# Altium project 充电桩底板V1.1.PrjPcb
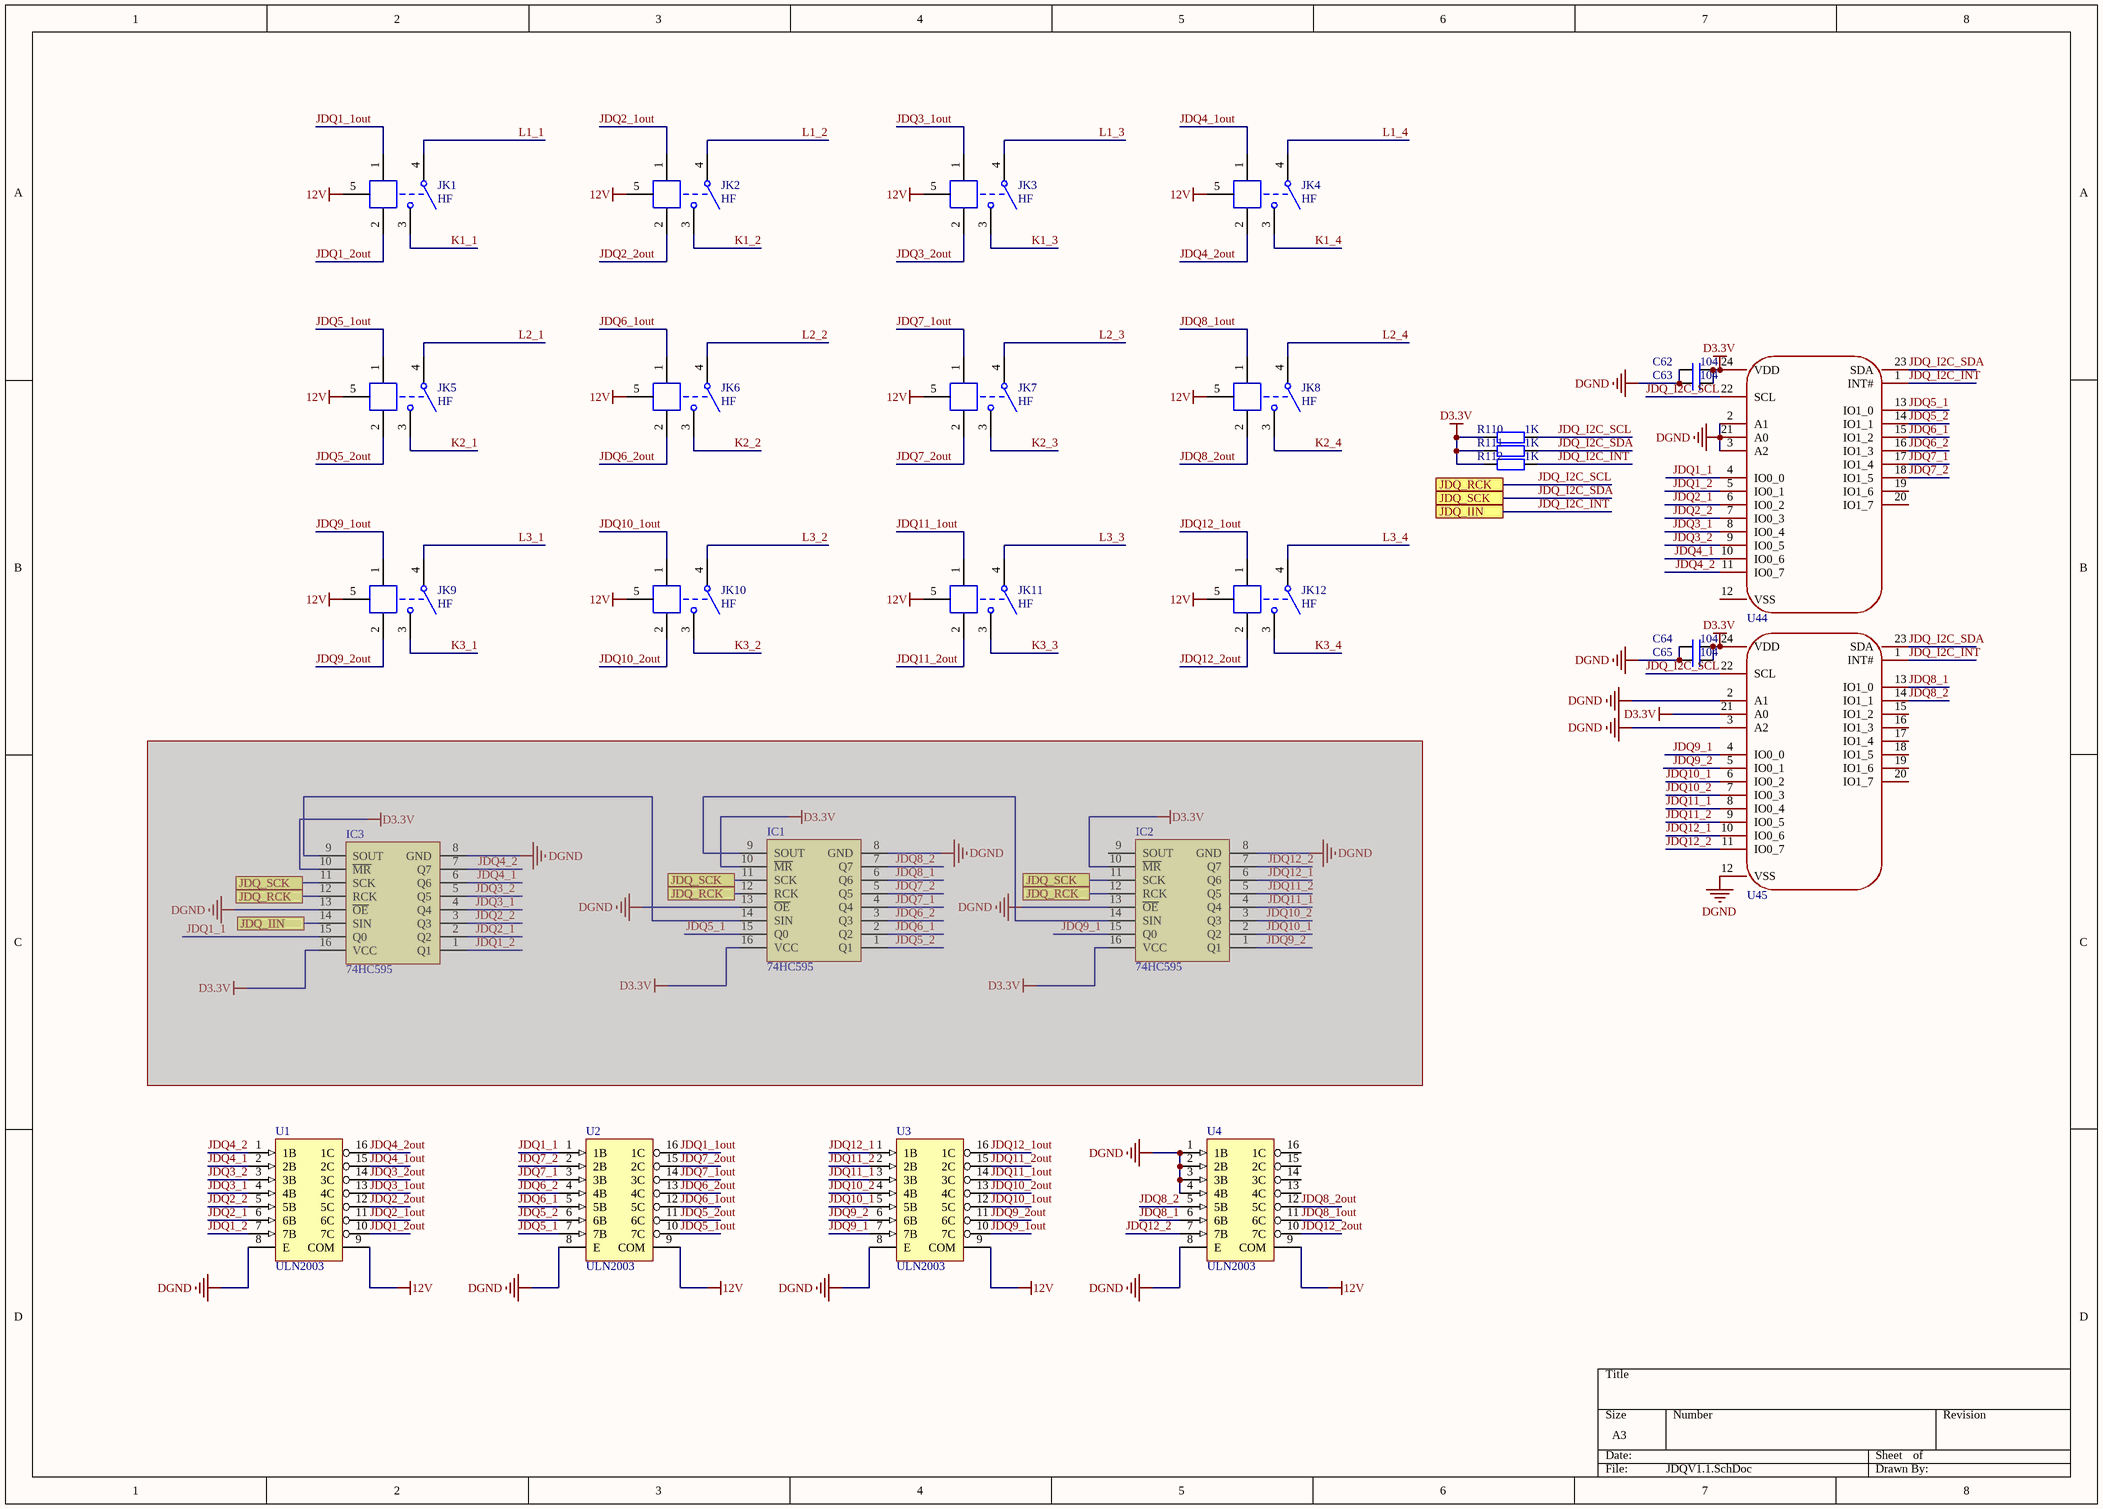
[diagram p0: JDQV1.1.SchDoc]
3 sheets, 332 parts. Net scope: global (net labels, ports and power ports of the same name join across sheets).
Board file: CDJDBV1.1.PcbDoc
Sheets:
  JDQV1.1.SchDoc
  DNJLV1.1.SchDoc
  connectV1.1.SchDoc

## Sheet JDQV1.1.SchDoc
size A3; SheetNumber: 1; SheetTotal: 3

### Parts
(Parts that share a designator on the sheet are numbered #1, #2 ... from top to bottom, then left to right.)
C62  104  [C 0603_L]
C63  104  [C 0603_L]
C64  104  [C 0603_L]
C65  104  [C 0603_L]
IC1#1  74HC595  [SOP16_N]  (masked out: inside a compile mask, not in the netlist)
IC2#1  74HC595  [SOP16_N]  (masked out: inside a compile mask, not in the netlist)
IC3  74HC595  [SOP16_N]  (masked out: inside a compile mask, not in the netlist)
JK1  HF  [HF163F-L16]
JK2  HF  [HF163F-L16]
JK3  HF  [HF163F-L16]
JK4  HF  [HF163F-L16]
JK5  HF  [HF163F-L16]
JK6  HF  [HF163F-L16]
JK7  HF  [HF163F-L16]
JK8  HF  [HF163F-L16]
JK9  HF  [HF163F-L16]
JK10  HF  [HF163F-L16]
JK11  HF  [HF163F-L16]
JK12  HF  [HF163F-L16]
R110  1K  [R 0603_L]
R111  1K  [R 0603_L]
R112  1K  [R 0603_L]
U1  ULN2003  [SOP16_M]
U2  ULN2003  [SOP16_M]
U3  ULN2003  [SOP16_M]
U4  ULN2003  [SOP16_M]
U44  PCA9555PW,118  [TSSOP-24]  (value not drawn)
U45  PCA9555PW,118  [TSSOP-24]  (value not drawn)

### Ports
JDQ_IIN, JDQ_RCK, JDQ_SCK

### Nets
12V: JK1.5(G) JK2.5(G) JK3.5(G) JK4.5(G) JK5.5(G) JK6.5(G) JK7.5(G) JK8.5(G) JK9.5(G) JK10.5(G) JK11.5(G) JK12.5(G) U1.9(COM) U2.9(COM) U3.9(COM) U4.9(COM)
D3.3V: C62.2 C63.2 C64.2 C65.2 R110.1 R111.1 R112.1 U44.24(VDD) U45.21(A0) U45.24(VDD)
DGND: C62.1 C63.1 C64.1 C65.1 U1.8(E) U2.8(E) U3.8(E) U4.1(1B) U4.2(2B) U4.3(3B) U4.4(4B) U4.8(E) U44.2(A1) U44.3(A2) U44.21(A0) U45.2(A1) U45.3(A2) U45.12(VSS)
JDQ1_1: U2.1(1B) U44.4(IO0_0)
JDQ1_1out: JK1.1 U2.16(1C)
JDQ1_2: U1.7(7B) U44.5(IO0_1)
JDQ1_2out: JK1.2 U1.10(7C)
JDQ2_1: U1.6(6B) U44.6(IO0_2)
JDQ2_1out: JK2.1 U1.11(6C)
JDQ2_2: U1.5(5B) U44.7(IO0_3)
JDQ2_2out: JK2.2 U1.12(5C)
JDQ3_1: U1.4(4B) U44.8(IO0_4)
JDQ3_1out: JK3.1 U1.13(4C)
JDQ3_2: U1.3(3B) U44.9(IO0_5)
JDQ3_2out: JK3.2 U1.14(3C)
JDQ4_1: U1.2(2B) U44.10(IO0_6)
JDQ4_1out: JK4.1 U1.15(2C)
JDQ4_2: U1.1(1B) U44.11(IO0_7)
JDQ4_2out: JK4.2 U1.16(1C)
JDQ5_1: U2.7(7B) U44.13(IO1_0)
JDQ5_1out: JK5.1 U2.10(7C)
JDQ5_2: U2.6(6B) U44.14(IO1_1)
JDQ5_2out: JK5.2 U2.11(6C)
JDQ6_1: U2.5(5B) U44.15(IO1_2)
JDQ6_1out: JK6.1 U2.12(5C)
JDQ6_2: U2.4(4B) U44.16(IO1_3)
JDQ6_2out: JK6.2 U2.13(4C)
JDQ7_1: U2.3(3B) U44.17(IO1_4)
JDQ7_1out: JK7.1 U2.14(3C)
JDQ7_2: U2.2(2B) U44.18(IO1_5)
JDQ7_2out: JK7.2 U2.15(2C)
JDQ8_1: U4.6(6B) U45.13(IO1_0)
JDQ8_1out: JK8.1 U4.11(6C)
JDQ8_2: U4.5(5B) U45.14(IO1_1)
JDQ8_2out: JK8.2 U4.12(5C)
JDQ9_1: U3.7(7B) U45.4(IO0_0)
JDQ9_1out: JK9.1 U3.10(7C)
JDQ9_2: U3.6(6B) U45.5(IO0_1)
JDQ9_2out: JK9.2 U3.11(6C)
JDQ10_1: U3.5(5B) U45.6(IO0_2)
JDQ10_1out: JK10.1 U3.12(5C)
JDQ10_2: U3.4(4B) U45.7(IO0_3)
JDQ10_2out: JK10.2 U3.13(4C)
JDQ11_1: U3.3(3B) U45.8(IO0_4)
JDQ11_1out: JK11.1 U3.14(3C)
JDQ11_2: U3.2(2B) U45.9(IO0_5)
JDQ11_2out: JK11.2 U3.15(2C)
JDQ12_1: U3.1(1B) U45.10(IO0_6)
JDQ12_1out: JK12.1 U3.16(1C)
JDQ12_2: U4.7(7B) U45.11(IO0_7)
JDQ12_2out: JK12.2 U4.10(7C)
JDQ_I2C_INT: R112.2 U44.1(INT#) U45.1(INT#) ; port JDQ_IIN
JDQ_I2C_SCL: R110.2 U44.22(SCL) U45.22(SCL) ; port JDQ_RCK
JDQ_I2C_SDA: R111.2 U44.23(SDA) U45.23(SDA) ; port JDQ_SCK
K1_1: JK1.3
K1_2: JK2.3
K1_3: JK3.3
K1_4: JK4.3
K2_1: JK5.3
K2_2: JK6.3
K2_3: JK7.3
K2_4: JK8.3
K3_1: JK9.3
K3_2: JK10.3
K3_3: JK11.3
K3_4: JK12.3
L1_1: JK1.4
L1_2: JK2.4
L1_3: JK3.4
L1_4: JK4.4
L2_1: JK5.4
L2_2: JK6.4
L2_3: JK7.4
L2_4: JK8.4
L3_1: JK9.4
L3_2: JK10.4
L3_3: JK11.4
L3_4: JK12.4

Not connected (* = marked no-connect by the designer): U4 13(4C) 14(3C) 15(2C) 16(1C); U44 12(VSS) 19(IO1_6) 20(IO1_7); U45 15(IO1_2) 16(IO1_3) 17(IO1_4) 18(IO1_5) 19(IO1_6) 20(IO1_7)

### Library data of the parts
C62-C65 = C: 贴片电容; BOM名称: 无极性贴片电容; 淘宝ID: 封装库来自淘宝 ID：黄晶宝石; 联系售后，技术支持: https://shop463601444.taobao.com; 唯一出售店铺网址: https://shop463601444.taobao.com
IC1#1 IC2#1 IC3 = 74HC595: 8位移位寄存器; 版权归属: 源创客; BOM名称: 8位移位寄存器; 学习资源: www.ooocke.com
JK1-JK12 = HFE10: HF双线圈磁保持继电器
R110-R112 = R: 贴片电阻; 版权归属: 来自淘宝 ID：黄晶宝石; 封装库来自淘宝卖家 ID：黄晶宝石: 其他店铺购入均为盗版，不享受售后技术支持服务，请立即申请退款; BOM名称: 贴片电阻; 联系售后: https://shop463601444.taobao.com
U1-U4 = ULN2003-2: 达林顿驱动芯片; 版权归属: 源创客; BOM名称: 达林顿驱动芯片; 学习资源: www.ooocke.com
U44 U45 = PCA9555PW,118: 接口:I2C；SMBus;I/O数量:16;时钟频率:400kHz;; Manufacturer: NXP(恩智浦); Add into BOM: yes; Number of I/O: 16; Interrupt Output: 有中断输出; Output Type: 推挽式; Supply Voltage: 2.3V~5.5V; Output Source current: 10mA; Output Sink Current: 25mA; Clock Frequency: 400kHz; Symbol: PCA9555PW,118; Device: PCA9555PW,118; LCSC Part Name: 带中断的16位I2C总线和SMBus I/O端口; Supplier Part: C128392; Manufacturer Part: PCA9555PW,118; Supplier Footprint: TSSOP-24; JLCPCB Part Class: 扩展库; Datasheet: https://atta.szlcsc.com/upload/public/pdf/source/20170928/C133183_1506599719478995066.pdf; Supplier: LCSC; Convert to PCB: yes; Interface: I2C；SMBus; Operating Temperature: -40℃~+85℃

## Sheet DNJLV1.1.SchDoc
size A2; SheetNumber: 2; SheetTotal: 3
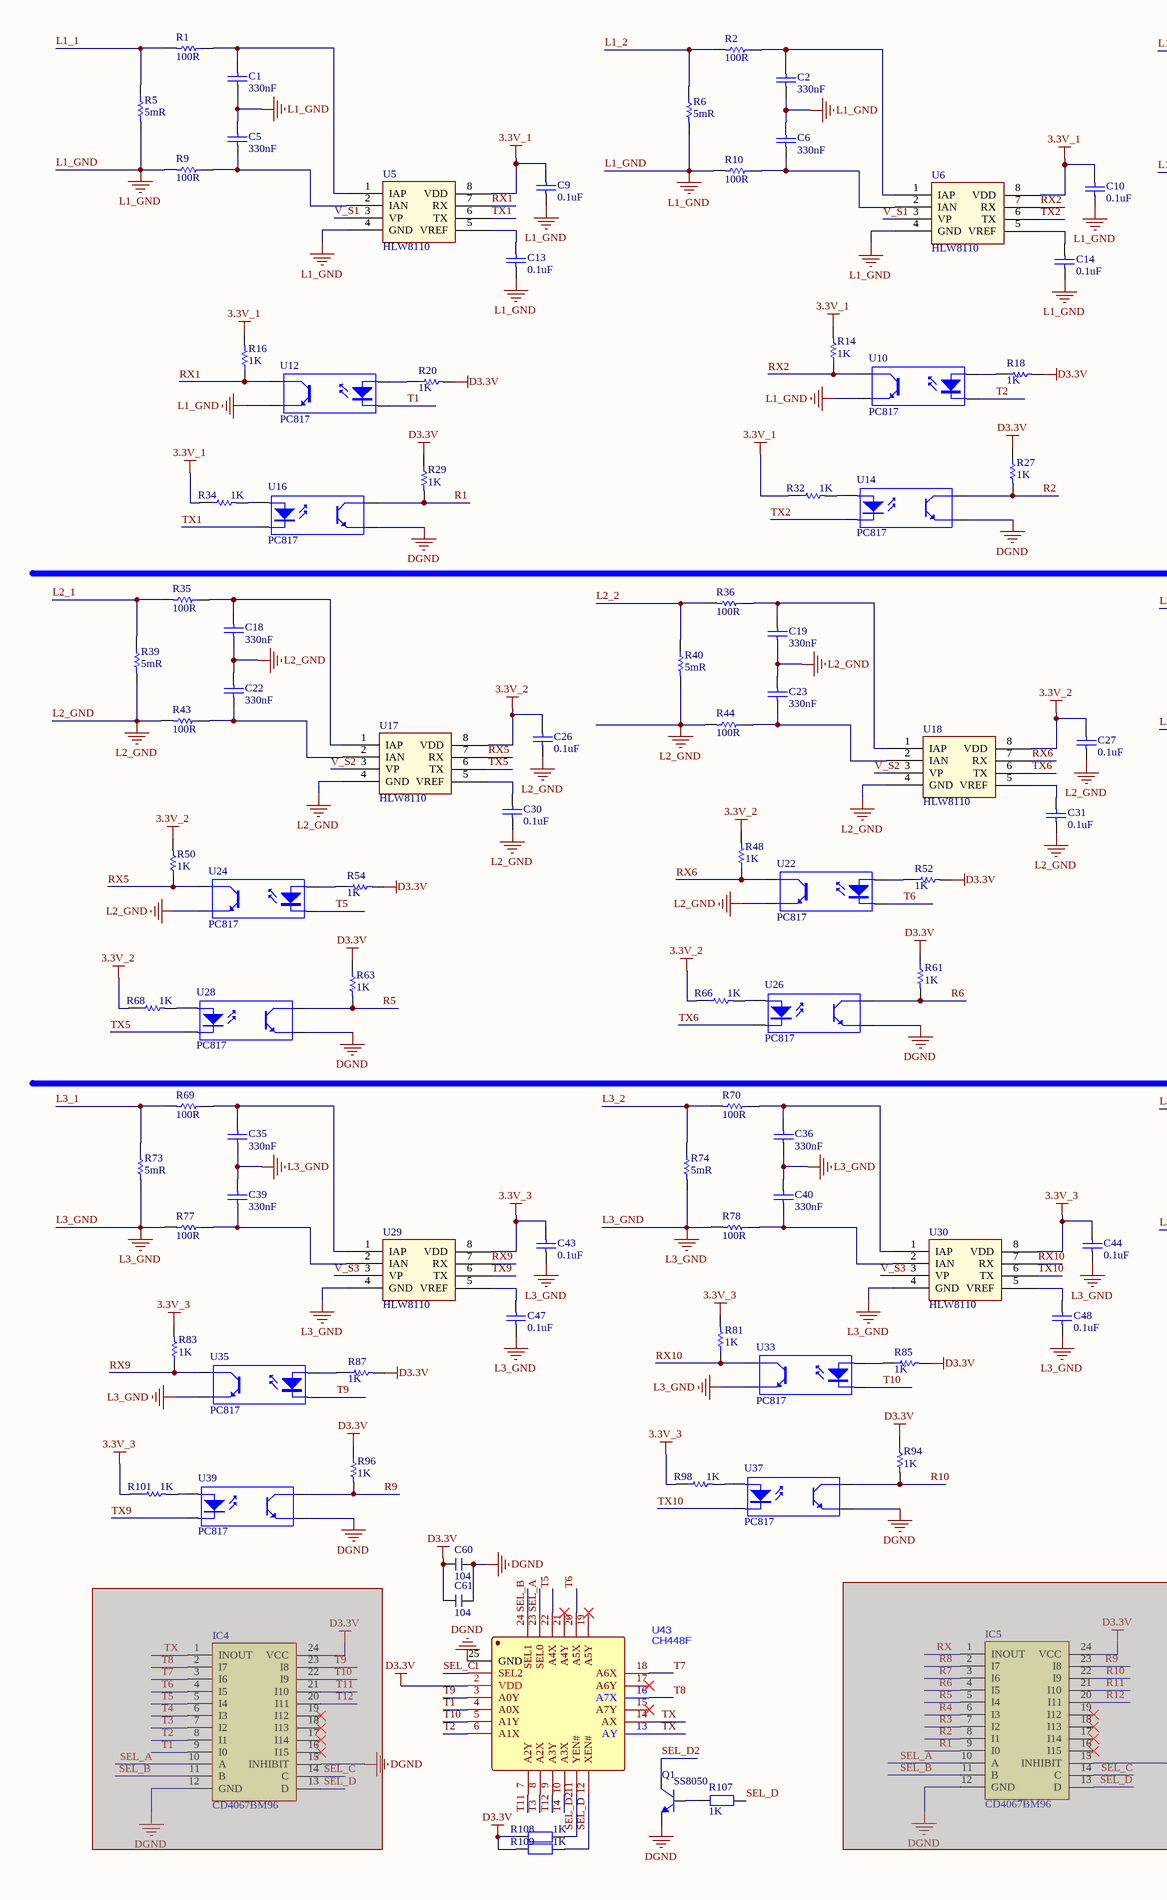
[diagram p1: DNJLV1.1.SchDoc, left]
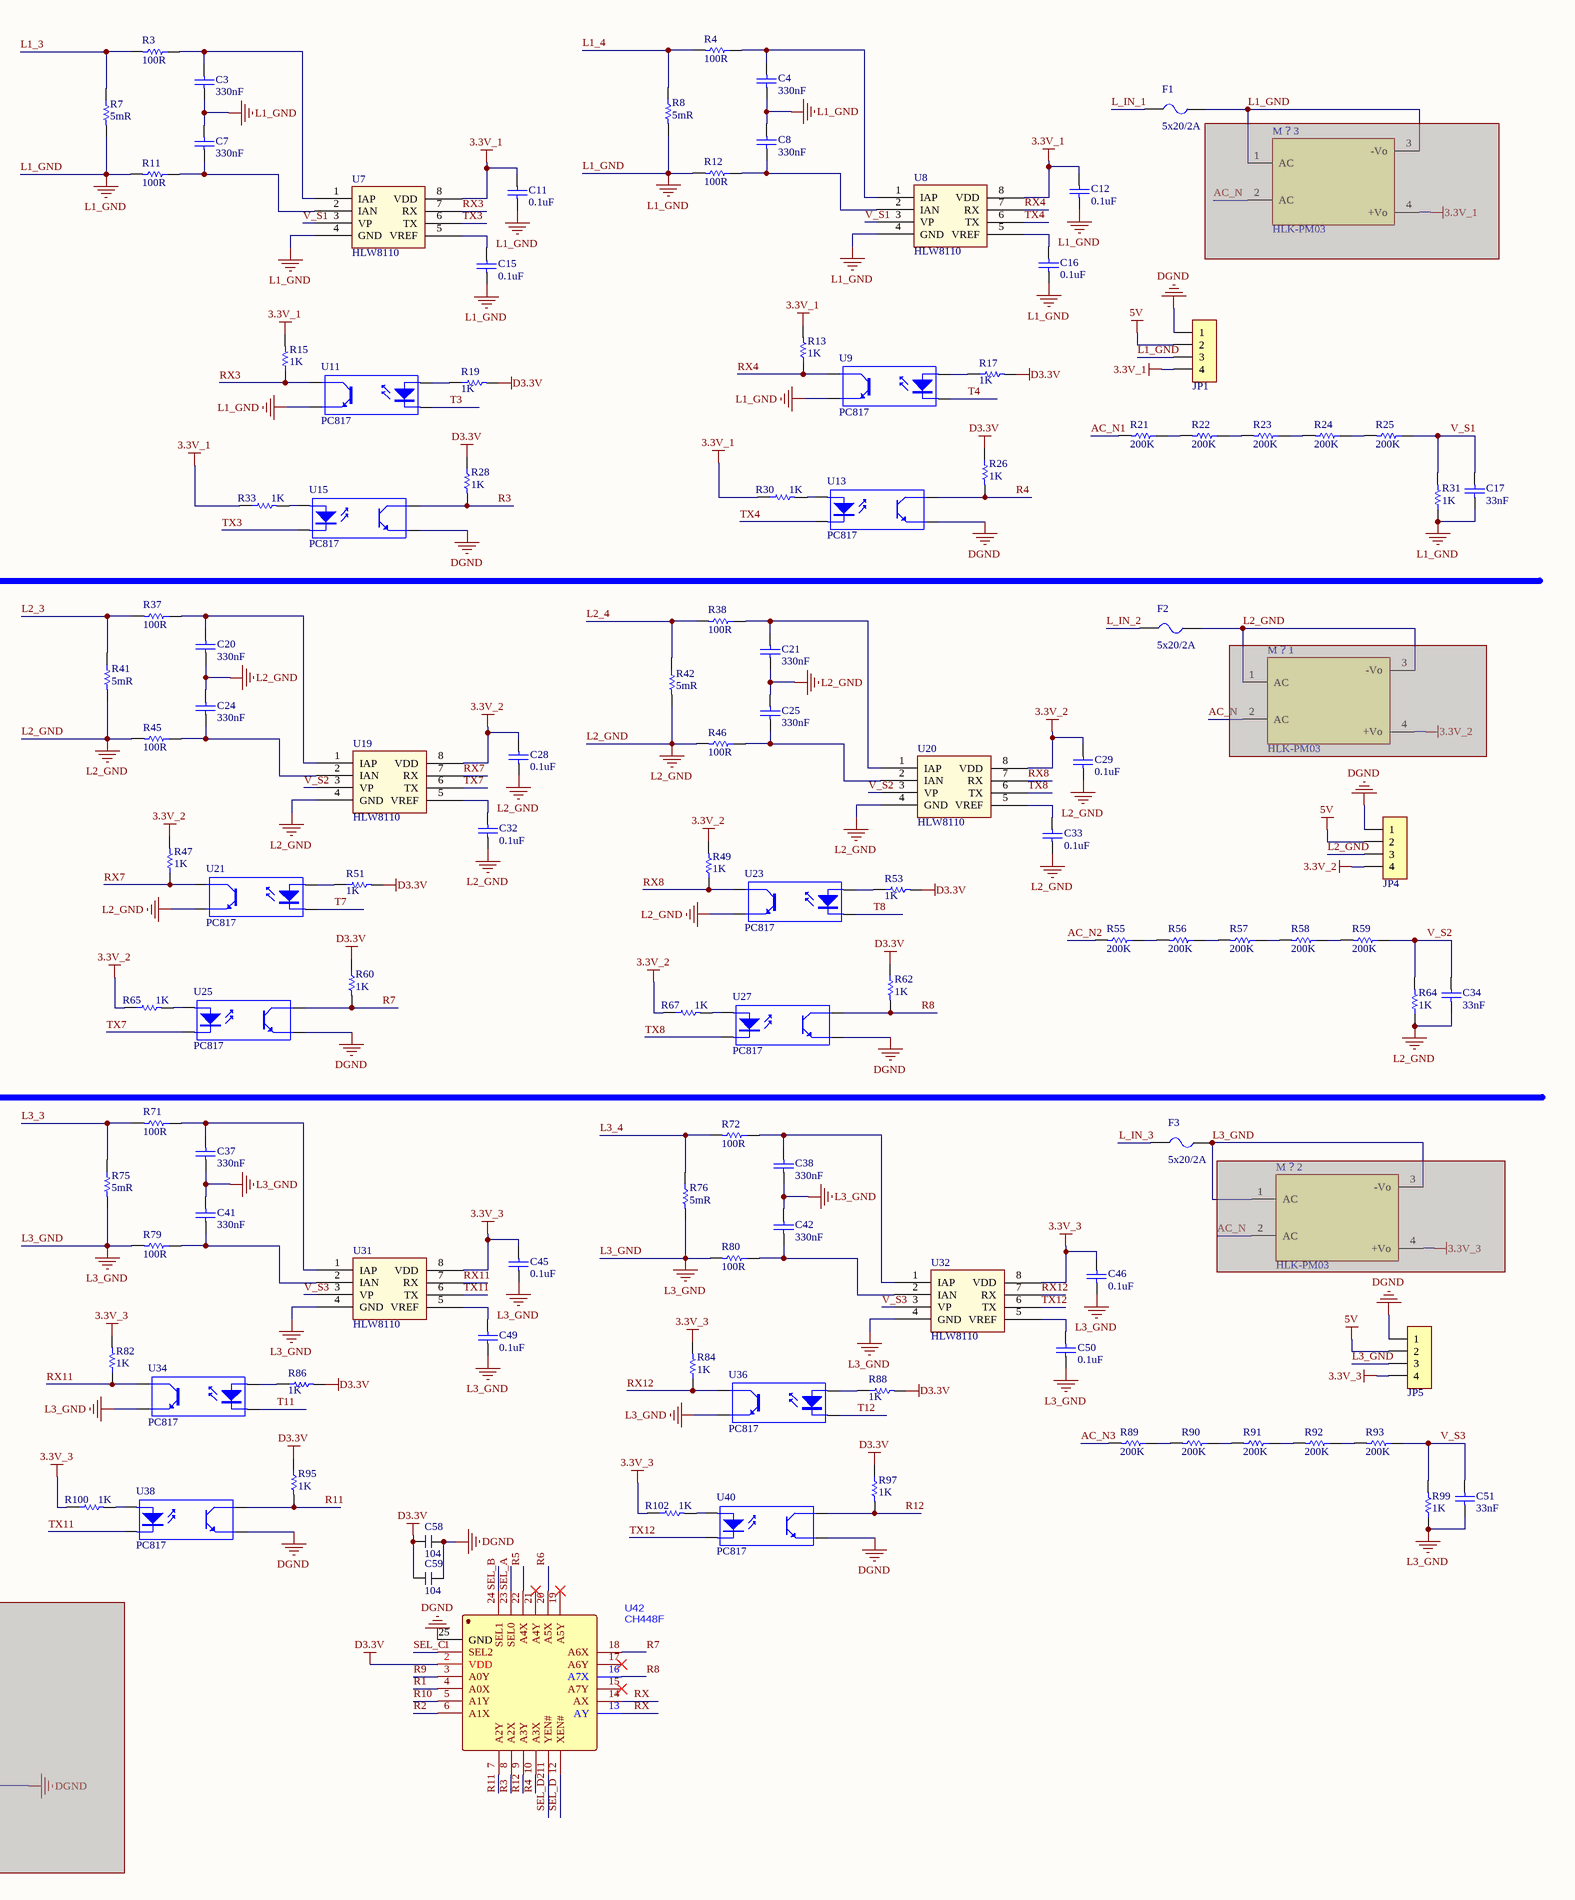
[diagram p2: DNJLV1.1.SchDoc, right]

### Parts
C1  330nF  [C 0805_L]
C2  330nF  [C 0805_L]
C3  330nF  [C 0805_L]
C4  330nF  [C 0805_L]
C5  330nF  [C 0805_L]
C6  330nF  [C 0805_L]
C7  330nF  [C 0805_L]
C8  330nF  [C 0805_L]
C9  0.1uF  [C 0805_L]
C10  0.1uF  [C 0805_L]
C11  0.1uF  [C 0805_L]
C12  0.1uF  [C 0805_L]
C13  0.1uF  [C 0805_L]
C14  0.1uF  [C 0805_L]
C15  0.1uF  [C 0805_L]
C16  0.1uF  [C 0805_L]
C17  33nF  [C 0805_L]
C18  330nF  [C 0805_L]
C19  330nF  [C 0805_L]
C20  330nF  [C 0805_L]
C21  330nF  [C 0805_L]
C22  330nF  [C 0805_L]
C23  330nF  [C 0805_L]
C24  330nF  [C 0805_L]
C25  330nF  [C 0805_L]
C26  0.1uF  [C 0805_L]
C27  0.1uF  [C 0805_L]
C28  0.1uF  [C 0805_L]
C29  0.1uF  [C 0805_L]
C30  0.1uF  [C 0805_L]
C31  0.1uF  [C 0805_L]
C32  0.1uF  [C 0805_L]
C33  0.1uF  [C 0805_L]
C34  33nF  [C 0805_L]
C35  330nF  [C 0805_L]
C36  330nF  [C 0805_L]
C37  330nF  [C 0805_L]
C38  330nF  [C 0805_L]
C39  330nF  [C 0805_L]
C40  330nF  [C 0805_L]
C41  330nF  [C 0805_L]
C42  330nF  [C 0805_L]
C43  0.1uF  [C 0805_L]
C44  0.1uF  [C 0805_L]
C45  0.1uF  [C 0805_L]
C46  0.1uF  [C 0805_L]
C47  0.1uF  [C 0805_L]
C48  0.1uF  [C 0805_L]
C49  0.1uF  [C 0805_L]
C50  0.1uF  [C 0805_L]
C51  33nF  [C 0805_L]
C58  104  [C 0603_L]
C59  104  [C 0603_L]
C60  104  [C 0603_L]
C61  104  [C 0603_L]
F1  5x20/2A  [FU BLX-A]
F2  5x20/2A  [FU BLX-A]
F3  5x20/2A  [FU BLX-A]
IC4  CD4067BM96  [SOP24_M]  (masked out: inside a compile mask, not in the netlist)
IC5  CD4067BM96  [SOP24_M]  (masked out: inside a compile mask, not in the netlist)
JP1  HDR-1X4  [HDR2.54-M-LI-4P]  (value not drawn)
JP4  HDR-1X4  [HDR2.54-M-LI-4P]  (value not drawn)
JP5  HDR-1X4  [HDR2.54-M-LI-4P]  (value not drawn)
M？1  HLK-PM03  [HLINK-PM03]  (masked out: inside a compile mask, not in the netlist)
M？2  HLK-PM03  [HLINK-PM03]  (masked out: inside a compile mask, not in the netlist)
M？3  HLK-PM03  [HLINK-PM03]  (masked out: inside a compile mask, not in the netlist)
Q1  SS8050  [SOT23-3N]
R1  100R  [R 0805_L]
R2  100R  [R 0805_L]
R3  100R  [R 0805_L]
R4  100R  [R 0805_L]
R5  5mR  [R 2512_L]
R6  5mR  [R 2512_L]
R7  5mR  [R 2512_L]
R8  5mR  [R 2512_L]
R9  100R  [R 0805_L]
R10  100R  [R 0805_L]
R11  100R  [R 0805_L]
R12  100R  [R 0805_L]
R13  1K  [R 0805_L]
R14  1K  [R 0805_L]
R15  1K  [R 0805_L]
R16  1K  [R 0805_L]
R17  1K  [R 0805_L]
R18  1K  [R 0805_L]
R19  1K  [R 0805_L]
R20  1K  [R 0805_L]
R21  200K  [R 0805_L]
R22  200K  [R 0805_L]
R23  200K  [R 0805_L]
R24  200K  [R 0805_L]
R25  200K  [R 0805_L]
R26  1K  [R 0805_L]
R27  1K  [R 0805_L]
R28  1K  [R 0805_L]
R29  1K  [R 0805_L]
R30  1K  [R 0805_L]
R31  1K  [R 0805_L]
R32  1K  [R 0805_L]
R33  1K  [R 0805_L]
R34  1K  [R 0805_L]
R35  100R  [R 0805_L]
R36  100R  [R 0805_L]
R37  100R  [R 0805_L]
R38  100R  [R 0805_L]
R39  5mR  [R 2512_L]
R40  5mR  [R 2512_L]
R41  5mR  [R 2512_L]
R42  5mR  [R 2512_L]
R43  100R  [R 0805_L]
R44  100R  [R 0805_L]
R45  100R  [R 0805_L]
R46  100R  [R 0805_L]
R47  1K  [R 0805_L]
R48  1K  [R 0805_L]
R49  1K  [R 0805_L]
R50  1K  [R 0805_L]
R51  1K  [R 0805_L]
R52  1K  [R 0805_L]
R53  1K  [R 0805_L]
R54  1K  [R 0805_L]
R55  200K  [R 0805_L]
R56  200K  [R 0805_L]
R57  200K  [R 0805_L]
R58  200K  [R 0805_L]
R59  200K  [R 0805_L]
R60  1K  [R 0805_L]
R61  1K  [R 0805_L]
R62  1K  [R 0805_L]
R63  1K  [R 0805_L]
R64  1K  [R 0805_L]
R65  1K  [R 0805_L]
R66  1K  [R 0805_L]
R67  1K  [R 0805_L]
R68  1K  [R 0805_L]
R69  100R  [R 0805_L]
R70  100R  [R 0805_L]
R71  100R  [R 0805_L]
R72  100R  [R 0805_L]
R73  5mR  [R 2512_L]
R74  5mR  [R 2512_L]
R75  5mR  [R 2512_L]
R76  5mR  [R 2512_L]
R77  100R  [R 0805_L]
R78  100R  [R 0805_L]
R79  100R  [R 0805_L]
R80  100R  [R 0805_L]
R81  1K  [R 0805_L]
R82  1K  [R 0805_L]
R83  1K  [R 0805_L]
R84  1K  [R 0805_L]
R85  1K  [R 0805_L]
R86  1K  [R 0805_L]
R87  1K  [R 0805_L]
R88  1K  [R 0805_L]
R89  200K  [R 0805_L]
R90  200K  [R 0805_L]
R91  200K  [R 0805_L]
R92  200K  [R 0805_L]
R93  200K  [R 0805_L]
R94  1K  [R 0805_L]
R95  1K  [R 0805_L]
R96  1K  [R 0805_L]
R97  1K  [R 0805_L]
R98  1K  [R 0805_L]
R99  1K  [R 0805_L]
R100  1K  [R 0805_L]
R101  1K  [R 0805_L]
R102  1K  [R 0805_L]
R107  1K  [R 0603_L]
R108  1K  [R 0603_L]
R109  1K  [R 0603_L]
U5  HLW8110  [HM8110]
U6  HLW8110  [HM8110]
U7  HLW8110  [HM8110]
U8  HLW8110  [HM8110]
U9  PC817  [SO-4]
U10  PC817  [SO-4]
U11  PC817  [SO-4]
U12  PC817  [SO-4]
U13  PC817  [SO-4]
U14  PC817  [SO-4]
U15  PC817  [SO-4]
U16  PC817  [SO-4]
U17  HLW8110  [HM8110]
U18  HLW8110  [HM8110]
U19  HLW8110  [HM8110]
U20  HLW8110  [HM8110]
U21  PC817  [SO-4]
U22  PC817  [SO-4]
U23  PC817  [SO-4]
U24  PC817  [SO-4]
U25  PC817  [SO-4]
U26  PC817  [SO-4]
U27  PC817  [SO-4]
U28  PC817  [SO-4]
U29  HLW8110  [HM8110]
U30  HLW8110  [HM8110]
U31  HLW8110  [HM8110]
U32  HLW8110  [HM8110]
U33  PC817  [SO-4]
U34  PC817  [SO-4]
U35  PC817  [SO-4]
U36  PC817  [SO-4]
U37  PC817  [SO-4]
U38  PC817  [SO-4]
U39  PC817  [SO-4]
U40  PC817  [SO-4]
U42  CH448F  [QFN24 4x4_M]
U43  CH448F  [QFN24 4x4_M]

### Nets
3.3V_1: C9.1 C10.1 C11.1 C12.1 JP1.4 R13.2 R14.2 R15.2 R16.2 R30.1 R32.1 R33.1 R34.1 U5.8(VDD) U6.8(VDD) U7.8(VDD) U8.8(VDD)
3.3V_2: C26.1 C27.1 C28.1 C29.1 JP4.4 R47.2 R48.2 R49.2 R50.2 R65.1 R66.1 R67.1 R68.1 U17.8(VDD) U18.8(VDD) U19.8(VDD) U20.8(VDD)
3.3V_3: C43.1 C44.1 C45.1 C46.1 JP5.4 R81.2 R82.2 R83.2 R84.2 R98.1 R100.1 R101.1 R102.1 U29.8(VDD) U30.8(VDD) U31.8(VDD) U32.8(VDD)
5V: JP1.2 JP4.2 JP5.2
D3.3V: C58.1 C59.1 C60.1 C61.1 R17.2 R18.2 R19.2 R20.2 R26.1 R27.1 R28.1 R29.1 R51.2 R52.2 R53.2 R54.2 R60.1 R61.1 R62.1 R63.1 R85.2 R86.2 R87.2 R88.2 R94.1 R95.1 R96.1 R97.1 R108.2 R109.2 U42.2(VDD) U43.2(VDD)
DGND: C58.2 C59.2 C60.2 C61.2 JP1.1 JP4.1 JP5.1 Q1.2(E) U13.3(E) U14.3(E) U15.3(E) U16.3(E) U25.3(E) U26.3(E) U27.3(E) U28.3(E) U37.3(E) U38.3(E) U39.3(E) U40.3(E) U42.25(GND) U43.25(GND)
L1_GND: C1.1 C2.1 C3.1 C4.1 C5.2 C6.2 C7.2 C8.2 C9.2 C10.2 C11.2 C12.2 C13.1 C14.1 C15.1 C16.1 C17.1 F1.1 JP1.3 R5.2 R6.2 R7.2 R8.2 R9.2 R10.2 R11.2 R12.2 R31.1 U5.4(GND) U6.4(GND) U7.4(GND) U8.4(GND) U9.3(E) U10.3(E) U11.3(E) U12.3(E)
L2_GND: C18.1 C19.1 C20.1 C21.1 C22.2 C23.2 C24.2 C25.2 C26.2 C27.2 C28.2 C29.2 C30.1 C31.1 C32.1 C33.1 C34.1 F2.1 JP4.3 R39.2 R40.2 R41.2 R42.2 R43.2 R44.2 R45.2 R46.2 R64.1 U17.4(GND) U18.4(GND) U19.4(GND) U20.4(GND) U21.3(E) U22.3(E) U23.3(E) U24.3(E)
L3_GND: C35.1 C36.1 C37.1 C38.1 C39.2 C40.2 C41.2 C42.2 C43.2 C44.2 C45.2 C46.2 C47.1 C48.1 C49.1 C50.1 C51.1 F3.1 JP5.3 R73.2 R74.2 R75.2 R76.2 R77.2 R78.2 R79.2 R80.2 R99.1 U29.4(GND) U30.4(GND) U31.4(GND) U32.4(GND) U33.3(E) U34.3(E) U35.3(E) U36.3(E)
AC_N1: R21.2
AC_N2: R55.2
AC_N3: R89.2
L1_1: R1.2 R5.1
L1_2: R2.2 R6.1
L1_3: R3.2 R7.1
L1_4: R4.2 R8.1
L2_1: R35.2 R39.1
L2_2: R36.2 R40.1
L2_3: R37.2 R41.1
L2_4: R38.2 R42.1
L3_1: R69.2 R73.1
L3_2: R70.2 R74.1
L3_3: R71.2 R75.1
L3_4: R72.2 R76.1
L_IN_1: F1.2
L_IN_2: F2.2
L_IN_3: F3.2
R1: R29.2 U16.4(C) U42.4(A0X)
R2: R27.2 U14.4(C) U42.6(A1X)
R3: R28.2 U15.4(C) U42.8(A2X)
R4: R26.2 U13.4(C) U42.10(A3X)
R5: R63.2 U28.4(C) U42.22(A4X)
R6: R61.2 U26.4(C) U42.20(A5X)
R7: R60.2 U25.4(C) U42.18(A6X)
R8: R62.2 U27.4(C) U42.16(A7X)
R9: R96.2 U39.4(C) U42.3(A0Y)
R10: R94.2 U37.4(C) U42.5(A1Y)
R11: R95.2 U38.4(C) U42.7(A2Y)
R12: R97.2 U40.4(C) U42.9(A3Y)
RX: U42.13(AY) U42.14(AX)
RX1: R16.1 U5.7(RX) U12.4(C)
RX2: R14.1 U6.7(RX) U10.4(C)
RX3: R15.1 U7.7(RX) U11.4(C)
RX4: R13.1 U8.7(RX) U9.4(C)
RX5: R50.1 U17.7(RX) U24.4(C)
RX6: R48.1 U18.7(RX) U22.4(C)
RX7: R47.1 U19.7(RX) U21.4(C)
RX8: R49.1 U20.7(RX) U23.4(C)
RX9: R83.1 U29.7(RX) U35.4(C)
RX10: R81.1 U30.7(RX) U33.4(C)
RX11: R82.1 U31.7(RX) U34.4(C)
RX12: R84.1 U32.7(RX) U36.4(C)
SEL_A: U42.23(SEL0) U43.23(SEL0)
SEL_B: U42.24(SEL1) U43.24(SEL1)
SEL_C: U42.1(SEL2) U43.1(SEL2)
SEL_D: R107.2 R109.1 U42.12(XEN#) U43.12(XEN#)
SEL_D2: Q1.3(C) R108.1 U42.11(YEN#) U43.11(YEN#)
T1: U12.2(K) U43.4(A0X)
T2: U10.2(K) U43.6(A1X)
T3: U11.2(K) U43.8(A2X)
T4: U9.2(K) U43.10(A3X)
T5: U24.2(K) U43.22(A4X)
T6: U22.2(K) U43.20(A5X)
T7: U21.2(K) U43.18(A6X)
T8: U23.2(K) U43.16(A7X)
T9: U35.2(K) U43.3(A0Y)
T10: U33.2(K) U43.5(A1Y)
T11: U34.2(K) U43.7(A2Y)
T12: U36.2(K) U43.9(A3Y)
TX: U43.13(AY) U43.14(AX)
TX1: U5.6(TX) U16.2(K)
TX2: U6.6(TX) U14.2(K)
TX3: U7.6(TX) U15.2(K)
TX4: U8.6(TX) U13.2(K)
TX5: U17.6(TX) U28.2(K)
TX6: U18.6(TX) U26.2(K)
TX7: U19.6(TX) U25.2(K)
TX8: U20.6(TX) U27.2(K)
TX9: U29.6(TX) U39.2(K)
TX10: U30.6(TX) U37.2(K)
TX11: U31.6(TX) U38.2(K)
TX12: U32.6(TX) U40.2(K)
V_S1: C17.2 R25.1 R31.2 U5.3(VP) U6.3(VP) U7.3(VP) U8.3(VP)
V_S2: C34.2 R59.1 R64.2 U17.3(VP) U18.3(VP) U19.3(VP) U20.3(VP)
V_S3: C51.2 R93.1 R99.2 U29.3(VP) U30.3(VP) U31.3(VP) U32.3(VP)
NetC1_2: C1.2 R1.1 U5.1(IAP)
NetC2_2: C2.2 R2.1 U6.1(IAP)
NetC3_2: C3.2 R3.1 U7.1(IAP)
NetC4_2: C4.2 R4.1 U8.1(IAP)
NetC5_1: C5.1 R9.1 U5.2(IAN)
NetC6_1: C6.1 R10.1 U6.2(IAN)
NetC7_1: C7.1 R11.1 U7.2(IAN)
NetC8_1: C8.1 R12.1 U8.2(IAN)
NetC13_2: C13.2 U5.5(VREF)
NetC14_2: C14.2 U6.5(VREF)
NetC15_2: C15.2 U7.5(VREF)
NetC16_2: C16.2 U8.5(VREF)
NetC18_2: C18.2 R35.1 U17.1(IAP)
NetC19_2: C19.2 R36.1 U18.1(IAP)
NetC20_2: C20.2 R37.1 U19.1(IAP)
NetC21_2: C21.2 R38.1 U20.1(IAP)
NetC22_1: C22.1 R43.1 U17.2(IAN)
NetC23_1: C23.1 R44.1 U18.2(IAN)
NetC24_1: C24.1 R45.1 U19.2(IAN)
NetC25_1: C25.1 R46.1 U20.2(IAN)
NetC30_2: C30.2 U17.5(VREF)
NetC31_2: C31.2 U18.5(VREF)
NetC32_2: C32.2 U19.5(VREF)
NetC33_2: C33.2 U20.5(VREF)
NetC35_2: C35.2 R69.1 U29.1(IAP)
NetC36_2: C36.2 R70.1 U30.1(IAP)
NetC37_2: C37.2 R71.1 U31.1(IAP)
NetC38_2: C38.2 R72.1 U32.1(IAP)
NetC39_1: C39.1 R77.1 U29.2(IAN)
NetC40_1: C40.1 R78.1 U30.2(IAN)
NetC41_1: C41.1 R79.1 U31.2(IAN)
NetC42_1: C42.1 R80.1 U32.2(IAN)
NetC47_2: C47.2 U29.5(VREF)
NetC48_2: C48.2 U30.5(VREF)
NetC49_2: C49.2 U31.5(VREF)
NetC50_2: C50.2 U32.5(VREF)
NetQ1_1: Q1.1(B) R107.1
NetR17_1: R17.1 U9.1(A)
NetR18_1: R18.1 U10.1(A)
NetR19_1: R19.1 U11.1(A)
NetR20_1: R20.1 U12.1(A)
NetR21_1: R21.1 R22.2
NetR22_1: R22.1 R23.2
NetR23_1: R23.1 R24.2
NetR24_1: R24.1 R25.2
NetR30_2: R30.2 U13.1(A)
NetR32_2: R32.2 U14.1(A)
NetR33_2: R33.2 U15.1(A)
NetR34_2: R34.2 U16.1(A)
NetR51_1: R51.1 U21.1(A)
NetR52_1: R52.1 U22.1(A)
NetR53_1: R53.1 U23.1(A)
NetR54_1: R54.1 U24.1(A)
NetR55_1: R55.1 R56.2
NetR56_1: R56.1 R57.2
NetR57_1: R57.1 R58.2
NetR58_1: R58.1 R59.2
NetR65_2: R65.2 U25.1(A)
NetR66_2: R66.2 U26.1(A)
NetR67_2: R67.2 U27.1(A)
NetR68_2: R68.2 U28.1(A)
NetR85_1: R85.1 U33.1(A)
NetR86_1: R86.1 U34.1(A)
NetR87_1: R87.1 U35.1(A)
NetR88_1: R88.1 U36.1(A)
NetR89_1: R89.1 R90.2
NetR90_1: R90.1 R91.2
NetR91_1: R91.1 R92.2
NetR92_1: R92.1 R93.2
NetR98_2: R98.2 U37.1(A)
NetR100_2: R100.2 U38.1(A)
NetR101_2: R101.2 U39.1(A)
NetR102_2: R102.2 U40.1(A)

Not connected (* = marked no-connect by the designer): U42 15(A7Y)* 17(A6Y)* 19(A5Y)* 21(A4Y)*; U43 15(A7Y)* 17(A6Y)* 19(A5Y)* 21(A4Y)*

### Library data of the parts
C1-C51 = Cap: Capacitor; Published: 8-Jun-2000; LatestRevisionDate: 17-Jul-2002; LatestRevisionNote: Re-released for DXP Platform.; PackageReference: RAD-0.3; Publisher: Altium Limited
  C1-C8 C18-C25 C35-C42: Value: 330nF
  C9-C16 C26-C33 C43-C50: Value: 0.1uF
  C17 C34 C51: Value: 33nF
C58-C61 = C: as C62 on sheet JDQV1.1; 联系售后，技术支持: https://shop463601444.taobao.com; 唯一出售店铺网址: https://shop463601444.taobao.com
F1-F3 = FU 5x20: 5*20保险丝; 版权归属: 源创客; BOM名称: 5*20保险丝; 学习资源: www.ooocke.com
IC4 IC5 = CD4067BM96: 16通道模拟开关
JP1 JP4 JP5 = Header 4: 4P接插件; 版权归属: 封装库来自淘宝 ID：黄晶宝石; BOM名称: 4P接插件; 学习资源: https://shop463601444.taobao.com
M？1-M？3 = Component_1: HI-LINK AC-DC3.3V电源模块
Q1 = 8050-SMD: 高频放大-NPN型; 版权归属: 封装库来自淘宝 ID：黄晶宝石; 属性: 40V 1.5A 1W 100MHZ; BOM名称: 高频放大-NPN型; 联系售后: https://shop463601444.taobao.com
R1-R12 R21-R25 R31 R35-R46 R55-R59 R64 R69-R80 R89-R93 R99 = Res: Resistor; Published: 8-Jun-2000; LatestRevisionDate: 17-Jul-2002; LatestRevisionNote: Re-released for DXP Platform.; PackageReference: AXIAL-0.3; Publisher: Altium Limited
  R1-R4 R9-R12 R35-R38 R43-R46 R69-R72 R77-R80: Value: 100R
  R5-R8 R39-R42 R73-R76: Value: 5mR
  R21-R25 R55-R59 R89-R93: Value: 200K
  R31 R64 R99: Value: 1K
R13-R20 R26-R30 R32-R34 R47-R54 R60-R63 R65-R68 R81-R88 R94-R98 R100-R102 = Res1: Resistor; Published: 8-Jun-2000; LatestRevisionDate: 17-Jul-2002; LatestRevisionNote: Re-released for DXP Platform.; Publisher: Altium Limited
R107-R109 = R: as R110 on sheet JDQV1.1; BOM名称: 贴片电阻; 联系售后: https://shop463601444.taobao.com
U9-U16 U21-U28 U33-U40 = Optoisolator1: 4-Pin Phototransistor Optocoupler; Published: 24-Mar-1999; LatestRevisionDate: 04-Mar-2005; LatestRevisionNote: Sch pins 3 & 4 Swapped.; DatasheetVersion: Nov-2003; PackageReference: DIP-4; Publisher: Altium Limited

## Sheet connectV1.1.SchDoc
size A4; SheetNumber: 3; SheetTotal: 3
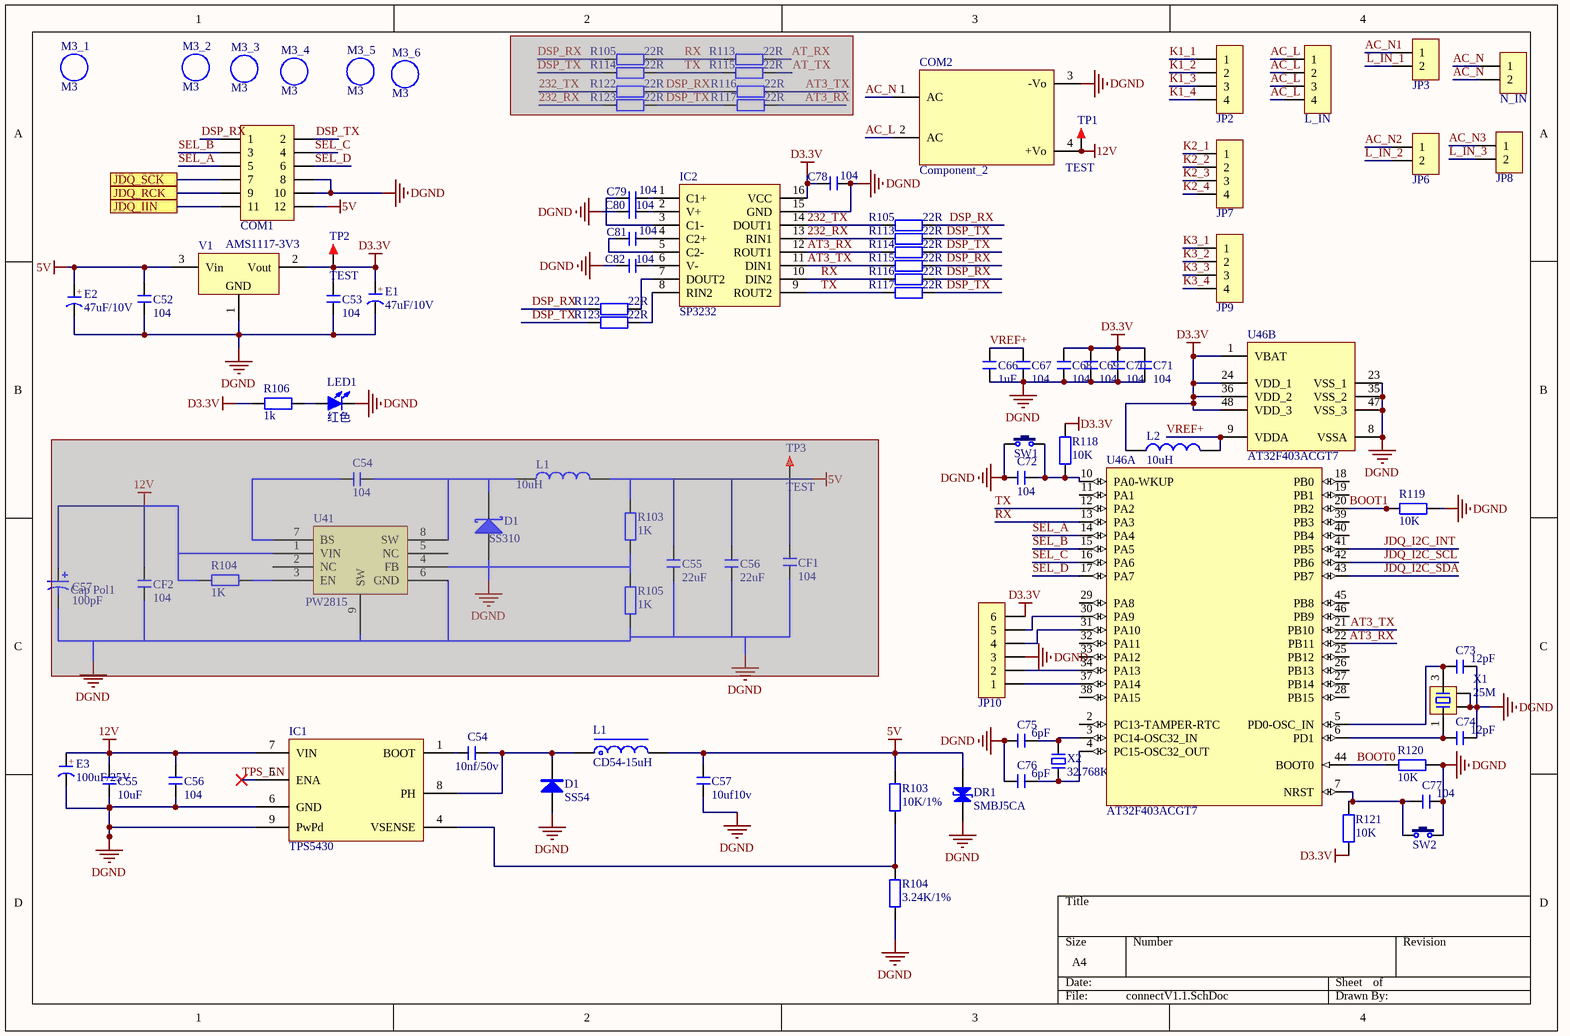
[diagram p3: connectV1.1.SchDoc]

### Parts
(Parts that share a designator on the sheet are numbered #1, #2 ... from top to bottom, then left to right.)
C52  104  [C 0805_L]
C53  104  [C 0805_L]
C54#1  104  [C 0805_L]  (masked out: inside a compile mask, not in the netlist)
C54#2  10nf/50v  [C 0603_L]
C55#1  22uF  [C 0805_M]  (masked out: inside a compile mask, not in the netlist)
C55#2  10uF  [C 0805_L]
C56#1  22uF  [C 0805_M]  (masked out: inside a compile mask, not in the netlist)
C56#2  104  [C 0603_L]
C57#1  Cap Pol1  value 100pF  [RB7.6-15]  (masked out: inside a compile mask, not in the netlist)
C57#2  10uf10v  [C 0603_L]
C66  1uF  [C 0603_L]
C67  104  [C 0603_L]
C68  104  [C 0603_L]
C69  104  [C 0603_L]
C70  104  [C 0603_L]
C71  104  [C 0603_L]
C72  104  [C 0603_L]
C73  12pF  [C 0603_L]
C74  12pF  [C 0603_L]
C75  6pF  [C 0603_L]
C76  6pF  [C 0603_L]
C77  104  [C 0603_L]
C78  104  [C 0603_L]
C79  104  [C 0603_L]
C80  104  [C 0603_L]
C81  104  [C 0603_L]
C82  104  [C 0603_L]
CF1  104  [C 0805_L]  (masked out: inside a compile mask, not in the netlist)
CF2  104  [C 0805_L]  (masked out: inside a compile mask, not in the netlist)
COM1  Header 6X2  [PHD2.0-LI-2x8P]  (value not drawn)
COM2  Component_2  [HLINK-PM12]
D1#1  SS310  [SMB]  (masked out: inside a compile mask, not in the netlist)
D1#2  SS54  [SMB]
DR1  SMBJ5CA  [TVS_SMB]
E1  47uF/10V  [CD C(6032)]
E2  47uF/10V  [CD C(6032)]
E3  100uF/25V  [CM D(6.3*7.7)]
IC1#2  TPS5430  [SOP8]
IC2#2  SP3232  [TSSOP16_N]
JP2  HDR-1X4  [KF7620-4P]  (value not drawn)
JP3  HDR-1X2  [KF7620-2P]  (value not drawn)
JP6  HDR-1X2  [KF7620-2P]  (value not drawn)
JP7  HDR-1X4  [KF7620-4P]  (value not drawn)
JP8  HDR-1X2  [KF7620-2P]  (value not drawn)
JP9  HDR-1X4  [KF7620-4P]  (value not drawn)
JP10  HDR-1X6  [HDR2.54-LI-6P]  (value not drawn)
L1#1  10uH  [AL0204]  (masked out: inside a compile mask, not in the netlist)
L1#2  CD54-15uH  [CDRH74]
L2  10uH  [L 0603]
L_IN  HDR-1X4  [KF7620-4P]  (value not drawn)
LED1  红色  [LED 0603R]
M3_1  M3  [M3 125X200]
M3_2  M3  [M3 125X200]
M3_3  M3  [M3 125X200]
M3_4  M3  [M3 125X200]
M3_5  M3  [M3 125X200]
M3_6  M3  [M3 125X200]
N_IN  HDR-1X2  [KF7620-2P]  (value not drawn)
R103#1  1K  [R 0805_L]  (masked out: inside a compile mask, not in the netlist)
R103#2  10K/1%  [R 0603_L]
R104#1  1K  [R 0805_L]  (masked out: inside a compile mask, not in the netlist)
R104#2  3.24K/1%  [R 0603_L]
R105#1  22R  [R 0603_L]  (masked out: inside a compile mask, not in the netlist)
R105#2  22R  [R 0603_L]
R105#3  1K  [R 0805_L]  (masked out: inside a compile mask, not in the netlist)
R106  1k  [R 0603_M]
R113#1  22R  [R 0603_L]  (masked out: inside a compile mask, not in the netlist)
R113#2  22R  [R 0603_L]
R114#1  22R  [R 0603_L]  (masked out: inside a compile mask, not in the netlist)
R114#2  22R  [R 0603_L]
R115#1  22R  [R 0603_L]  (masked out: inside a compile mask, not in the netlist)
R115#2  22R  [R 0603_L]
R116#1  22R  [R 0603_L]  (masked out: inside a compile mask, not in the netlist)
R116#2  22R  [R 0603_L]
R117#1  22R  [R 0603_L]  (masked out: inside a compile mask, not in the netlist)
R117#2  22R  [R 0603_L]
R118  10K  [R 0603_L]
R119  10K  [R 0603_L]
R120  10K  [R 0603_L]
R121  10K  [R 0603_L]
R122#1  22R  [R 0603_L]  (masked out: inside a compile mask, not in the netlist)
R122#2  22R  [R 0603_L]
R123#1  22R  [R 0603_L]  (masked out: inside a compile mask, not in the netlist)
R123#2  22R  [R 0603_L]
SW1  3x6x5  [TSW SMD-3*6*2.5]  (value not drawn)
SW2  3x6x5  [TSW SMD-3*6*2.5]  (value not drawn)
TP1  TEST  [TEST 1.6]
TP2  TEST  [TEST 1.6]
TP3  TEST  [TEST 1.6]  (masked out: inside a compile mask, not in the netlist)
U41  PW2815  [ESOP8_N]  (masked out: inside a compile mask, not in the netlist)
U46  AT32F403ACGT7  [LQFP48_N]  (parts A,B of 2)
V1  AMS1117-3V3  [SOT223_L]
X1  25M  [OSC 3225-4P]
X2  32.768K  [OSC 3215-2P]

### Ports
JDQ_IIN, JDQ_RCK, JDQ_SCK

### Nets
5V: C52.2 C57#2.2 COM1.12 DR1.1(A) E2.1(A) L1#2.2 R103#2.2 V1.3(Vin)
12V: C55#2.2 C56#2.2 COM2.4(+Vo) E3.1(A) IC1#2.7(VIN) TP1.1
D3.3V: C53.2 C68.2 C69.2 C70.2 C71.2 C78.2 E1.1(A) IC2#2.16(VCC) JP10.6 L2.1 R106.1 R118.2 R121.2 TP2.1 U46.1(VBAT) U46.24(VDD_1) U46.36(VDD_2) U46.48(VDD_3) V1.2(Vout)
DGND: C52.1 C53.1 C55#2.1 C56#2.1 C57#2.1 C66.1 C67.1 C68.1 C69.1 C70.1 C71.1 C72.1 C73.1 C74.1 C75.2 C76.2 C77.1 C78.1 C80.1 C82.1 COM1.8 COM1.10 COM2.3(-Vo) D1#2.1(A) DR1.2(K) E1.2(K) E2.2(K) E3.2(K) IC1#2.6(GND) IC1#2.9(PwPd) IC2#2.15(GND) JP10.3 LED1.2(K) R104#2.2 R119.1 R120.1 SW1.1 SW2.2 U46.8(VSSA) U46.23(VSS_1) U46.35(VSS_2) U46.47(VSS_3) V1.1(GND) X1.2 X1.4
232_RX: IC2#2.13(RIN1) R113#2.2
232_TX: IC2#2.14(DOUT1) R105#2.2
AC_L: COM2.2(AC) L_IN.1 L_IN.2 L_IN.3 L_IN.4
AC_N: COM2.1(AC) N_IN.1 N_IN.2
AC_N1: JP3.1
AC_N2: JP6.1
AC_N3: JP8.1
AT3_RX: IC2#2.12(ROUT1) R114#2.2 U46.22(PB11)
AT3_TX: IC2#2.11(DIN1) R115#2.2 U46.21(PB10)
BOOT0: R120.2 U46.44(BOOT0)
BOOT1: R119.2 U46.20(PB2)
DSP_RX: COM1.1 R105#2.1 R115#2.1 R116#2.1 R122#2.2
DSP_TX: COM1.2 R113#2.1 R114#2.1 R117#2.1 R123#2.2
JDQ_I2C_INT: COM1.11 U46.41(PB5) ; port JDQ_IIN
JDQ_I2C_SCL: COM1.9 U46.42(PB6) ; port JDQ_RCK
JDQ_I2C_SDA: COM1.7 U46.43(PB7) ; port JDQ_SCK
K1_1: JP2.1
K1_2: JP2.2
K1_3: JP2.3
K1_4: JP2.4
K2_1: JP7.1
K2_2: JP7.2
K2_3: JP7.3
K2_4: JP7.4
K3_1: JP9.1
K3_2: JP9.2
K3_3: JP9.3
K3_4: JP9.4
L_IN_1: JP3.2
L_IN_2: JP6.2
L_IN_3: JP8.2
RX: IC2#2.10(DIN2) R116#2.2 U46.13(PA3)
SEL_A: COM1.5 U46.14(PA4)
SEL_B: COM1.3 U46.15(PA5)
SEL_C: COM1.4 U46.16(PA6)
SEL_D: COM1.6 U46.17(PA7)
TPS_EN: IC1#2.5(ENA)
TX: IC2#2.9(ROUT2) R117#2.2 U46.12(PA2)
VREF+: C66.2 C67.2 L2.2 U46.9(VDDA)
NetC54#2_1: C54#2.1 IC1#2.1(BOOT)
NetC54#2_2: C54#2.2 D1#2.2(K) IC1#2.8(PH) L1#2.1
NetC72_2: C72.2 R118.1 SW1.2 U46.10(PA0-WKUP)
NetC73_2: C73.2 U46.5(PD0-OSC_IN) X1.3
NetC74_2: C74.2 U46.6(PD1) X1.1
NetC75_1: C75.1 U46.3(PC14-OSC32_IN) X2.2
NetC76_1: C76.1 U46.4(PC15-OSC32_OUT) X2.1
NetC77_2: C77.2 R121.1 SW2.1 U46.7(NRST)
NetC79_1: C79.1 IC2#2.1(C1+)
NetC79_2: C79.2 IC2#2.3(C1-)
NetC80_2: C80.2 IC2#2.2(V+)
NetC81_1: C81.1 IC2#2.4(C2+)
NetC81_2: C81.2 IC2#2.5(C2-)
NetC82_2: C82.2 IC2#2.6(V-)
NetIC1#2_4: IC1#2.4(VSENSE) R103#2.1 R104#2.1
NetIC2#2_7: IC2#2.7(DOUT2) R122#2.1
NetIC2#2_8: IC2#2.8(RIN2) R123#2.1
NetJP10_1: JP10.1 U46.37(PA14)
NetJP10_2: JP10.2 U46.34(PA13)
NetJP10_4: JP10.4 U46.31(PA10)
NetJP10_5: JP10.5 U46.30(PA9)
NetLED1_1: LED1.1(A) R106.2

Not connected (* = marked no-connect by the designer): U46 2(PC13-TAMPER-RTC) 11(PA1) 18(PB0) 19(PB1) 25(PB12) 26(PB13) 27(PB14) 28(PB15) 29(PA8) 32(PA11) 33(PA12) 38(PA15) 39(PB3) 40(PB4) 45(PB8) 46(PB9)

### Notes on the sheet
- (in symbol C-CD) +
- (in symbol C-CM) +

### Library data of the parts
C52 C53 C54#2 C55#1 C55#2 C56#1 C56#2 C57#2 C66-C82 = C: 无极性贴片电容; 版权归属: 源创客; BOM名称: 无极性贴片电容; 学习资源: www.ooocke.com
C54#1 CF1 CF2 = C: as C62 on sheet JDQV1.1; 联系售后，技术支持: https://shop463601444.taobao.com; 唯一出售店铺网址: https://shop463601444.taobao.com
C57#1 = Cap Pol1: Polarized Capacitor (Radial); Published: 8-Jun-2000; LatestRevisionDate: 17-Jul-2002; LatestRevisionNote: Re-released for DXP Platform.; PackageReference: RB7.6-15; Publisher: Altium Limited; PackageDescription: Polarized Capacitor (Radial); 2 Leads
COM1 = Header  6X2: 6*2P接插件; 版权归属: 源创客; BOM名称: 6*2P接插件; 学习资源: www.ooocke.com
COM2 = Component_2: HI-LINK AC-DC12V电源模块
D1#1 = Diode BAT17: Silicon RF Schottky Diode for Mixer Applications in the VHF/UHF Range; Note: Pin 2 is not connected and not drawn.; Published: 21-Mar-2003; LatestRevisionDate: 29-May-2009; LatestRevisionNote: IPC-7351 Footprint Added.; DatasheetVersion: Oct-1999; PackageVersion: Sep-2001; PackageReference: SOT-23; Publisher: Altium Limited; PackageDescription: 3-Pin SOT-23 Package 0.95 mm Pitch, 2.5 mm Lead Span; ComponentLink1Description: Manufacturer Link; ComponentLink1URL: http://www.infineon.com/; ComponentLink2Description: Datasheet; ComponentLink2URL: http://www.infineon.com/upload/Document/cmc_upload/documents/009/363/bat17series.pdf
D1#2 = 1N5819: 肖特基二极管; 版权归属: 源创客; 属性: 40V/2A; BOM名称: 肖特基二极管; 学习资源: www.ooocke.com
DR1 = DR: 瞬态电压抑制二极管; 版权归属: 源创客; BOM名称: 瞬态电压抑制二极管; 学习资源: www.ooocke.com
E1 E2 = C-CD: 贴片钽电容; 版权归属: 源创客; BOM名称: 贴片钽电容; 学习资源: www.ooocke.com
E3 = C-CM: 贴片电解电容; 版权归属: 源创客; BOM名称: 贴片电解电容; 学习资源: www.ooocke.com
IC1#2 = TPS5430: DC降压芯片
IC2#2 = SP3232: RS232通讯芯片; 版权归属: 封装库来自淘宝 ID：黄晶宝石; BOM名称: RS232通讯芯片; 学习资源: https://shop463601444.taobao.com
JP2 JP7 JP9 L_IN = Header 4: 4P接插件; 版权归属: 源创客; BOM名称: 4P接插件; 学习资源: www.ooocke.com
JP3 JP6 JP8 N_IN = Header 2: 2P接插件; 版权归属: 源创客; BOM名称: 2P接插件; 学习资源: www.ooocke.com
JP10 = Header 6: 6P接插件; 版权归属: 封装库来自淘宝 ID：黄晶宝石; BOM名称: 6P接插件; 学习资源: https://shop463601444.taobao.com
L1#1 = L-AL: 色环电感; 淘宝ID: 封装库来自淘宝 ID：黄晶宝石; BOM名称: 色环电感; 学习资源: https://shop463601444.taobao.com
L1#2 = L-CD: 贴片功率电感; BOM名称: 功率电感; 版权归属: 源创客; 学习资源: www.ooocke.com
L2 = L: 小功率贴片电感; 淘宝ID: 封装库来自淘宝 ID：黄晶宝石; 封装库来自淘宝卖家 ID：黄晶宝石: 其他店铺购入均为盗版，不享受售后技术支持服务，请立即申请退款; BOM名称: 小功率贴片电感; 联系售后: https://shop463601444.taobao.com
LED1 = LED-SMD: 贴片LED; 版权归属: 源创客; BOM名称: 贴片LED; 学习资源: www.ooocke.com
M3_1-M3_6 = M3: 铜柱孔; 版权归属: 源创客; BOM名称: 铜柱孔; 学习资源: www.ooocke.com
R103#1 R104#1 R105#3 = R: as R110 on sheet JDQV1.1; BOM名称: 贴片电阻; 联系售后: https://shop463601444.taobao.com
R103#2 R104#2 R105#1 R105#2 R106 R113#1 R113#2 R114#1 R114#2 R115#1 R115#2 R116#1 R116#2 R117#1 R117#2 R118-R121 R122#1 R122#2 R123#1 R123#2 = R: 贴片电阻; 版权归属: 源创客; BOM名称: 贴片电阻; 学习资源: www.ooocke.com
SW1 SW2 = TSW 3x6: 3x6轻触开关; 版权归属: 封装库来自淘宝 ID：黄晶宝石; BOM名称: 3x6轻触开关; 学习资源: https://shop463601444.taobao.com
TP1-TP3 = TEST: 测试点; 版权归属: 源创客; BOM名称: 测试点; 学习资源: www.ooocke.com
U46 = STM32F103C8T6: STM32 ARM-based 32-bit MCU Performance Line with 64 kB Flash, 20 kB Internal RAM, -40 to +85癈 Temperature, 48-Pin LQFP, Tray; DatasheetVersion: rev13.0, Apr-2011; PackageVersion: rev13, Apr-2011; PackageReference: LQFP48; PackageDescription: 48-Pin Low-Profile Quad Flat Pack, 7 x 7 mm Body, 0.5 mm Pitch (LQFP48); ComponentLink1Description: Manufacturer URL; ComponentLink1URL: http://www.st.com/; ComponentLink2Description: STM32F103 Datasheet; ComponentLink2URL: http://www.st.com/internet/com/TECHNICAL_RESOURCES/TECHNICAL_LITERATURE/DATASHEET/CD00161566.pdf; ComponentLink3Description: STM32 Family Web Page; ComponentLink3URL: www.st.com/stm32; 联系售后: https://shop463601444.taobao.com
V1 = AMS1117: 三端稳压芯片; BOM名称: 稳压芯片; 版权归属: 源创客; 学习资源: www.ooocke.com
X1 = XTAL-4P: 4脚无源晶振; 版权归属: 封装库来自淘宝卖家 ID：黄晶宝石; BOM名称: 4脚无源晶振; 学习资源: https://shop463601444.taobao.com
X2 = XTAL-2P: 2脚无源脚晶振; 版权归属: 封装库来自淘宝卖家 ID：黄晶宝石; BOM名称: 2脚无源脚晶振; 学习资源: https://shop463601444.taobao.com

## Nets that join several sheets
5V: DNJLV1.1 (JP1.2 JP4.2 JP5.2), connectV1.1 (8 pins)
12V: JDQV1.1 (16 pins), connectV1.1 (6 pins)
D3.3V: JDQV1.1 (10 pins), DNJLV1.1 (32 pins), connectV1.1 (19 pins)
DGND: JDQV1.1 (18 pins), DNJLV1.1 (22 pins), connectV1.1 (45 pins)
AC_N1: DNJLV1.1 (R21.2), connectV1.1 (JP3.1)
AC_N2: DNJLV1.1 (R55.2), connectV1.1 (JP6.1)
AC_N3: DNJLV1.1 (R89.2), connectV1.1 (JP8.1)
JDQ_I2C_INT: JDQV1.1 (R112.2 U44.1 U45.1), connectV1.1 (COM1.11 U46.41)
JDQ_I2C_SCL: JDQV1.1 (R110.2 U44.22 U45.22), connectV1.1 (COM1.9 U46.42)
JDQ_I2C_SDA: JDQV1.1 (R111.2 U44.23 U45.23), connectV1.1 (COM1.7 U46.43)
K1_1: JDQV1.1 (JK1.3), connectV1.1 (JP2.1)
K1_2: JDQV1.1 (JK2.3), connectV1.1 (JP2.2)
K1_3: JDQV1.1 (JK3.3), connectV1.1 (JP2.3)
K1_4: JDQV1.1 (JK4.3), connectV1.1 (JP2.4)
K2_1: JDQV1.1 (JK5.3), connectV1.1 (JP7.1)
K2_2: JDQV1.1 (JK6.3), connectV1.1 (JP7.2)
K2_3: JDQV1.1 (JK7.3), connectV1.1 (JP7.3)
K2_4: JDQV1.1 (JK8.3), connectV1.1 (JP7.4)
K3_1: JDQV1.1 (JK9.3), connectV1.1 (JP9.1)
K3_2: JDQV1.1 (JK10.3), connectV1.1 (JP9.2)
K3_3: JDQV1.1 (JK11.3), connectV1.1 (JP9.3)
K3_4: JDQV1.1 (JK12.3), connectV1.1 (JP9.4)
L1_1: JDQV1.1 (JK1.4), DNJLV1.1 (R1.2 R5.1)
L1_2: JDQV1.1 (JK2.4), DNJLV1.1 (R2.2 R6.1)
L1_3: JDQV1.1 (JK3.4), DNJLV1.1 (R3.2 R7.1)
L1_4: JDQV1.1 (JK4.4), DNJLV1.1 (R4.2 R8.1)
L2_1: JDQV1.1 (JK5.4), DNJLV1.1 (R35.2 R39.1)
L2_2: JDQV1.1 (JK6.4), DNJLV1.1 (R36.2 R40.1)
L2_3: JDQV1.1 (JK7.4), DNJLV1.1 (R37.2 R41.1)
L2_4: JDQV1.1 (JK8.4), DNJLV1.1 (R38.2 R42.1)
L3_1: JDQV1.1 (JK9.4), DNJLV1.1 (R69.2 R73.1)
L3_2: JDQV1.1 (JK10.4), DNJLV1.1 (R70.2 R74.1)
L3_3: JDQV1.1 (JK11.4), DNJLV1.1 (R71.2 R75.1)
L3_4: JDQV1.1 (JK12.4), DNJLV1.1 (R72.2 R76.1)
L_IN_1: DNJLV1.1 (F1.2), connectV1.1 (JP3.2)
L_IN_2: DNJLV1.1 (F2.2), connectV1.1 (JP6.2)
L_IN_3: DNJLV1.1 (F3.2), connectV1.1 (JP8.2)
RX: DNJLV1.1 (U42.13 U42.14), connectV1.1 (IC2#2.10 R116#2.2 U46.13)
SEL_A: DNJLV1.1 (U42.23 U43.23), connectV1.1 (COM1.5 U46.14)
SEL_B: DNJLV1.1 (U42.24 U43.24), connectV1.1 (COM1.3 U46.15)
SEL_C: DNJLV1.1 (U42.1 U43.1), connectV1.1 (COM1.4 U46.16)
SEL_D: DNJLV1.1 (R107.2 R109.1 U42.12 U43.12), connectV1.1 (COM1.6 U46.17)
TX: DNJLV1.1 (U43.13 U43.14), connectV1.1 (IC2#2.9 R117#2.2 U46.12)